# Altium schematic sheet 2016_Matrice_LED.SchDoc
size A4
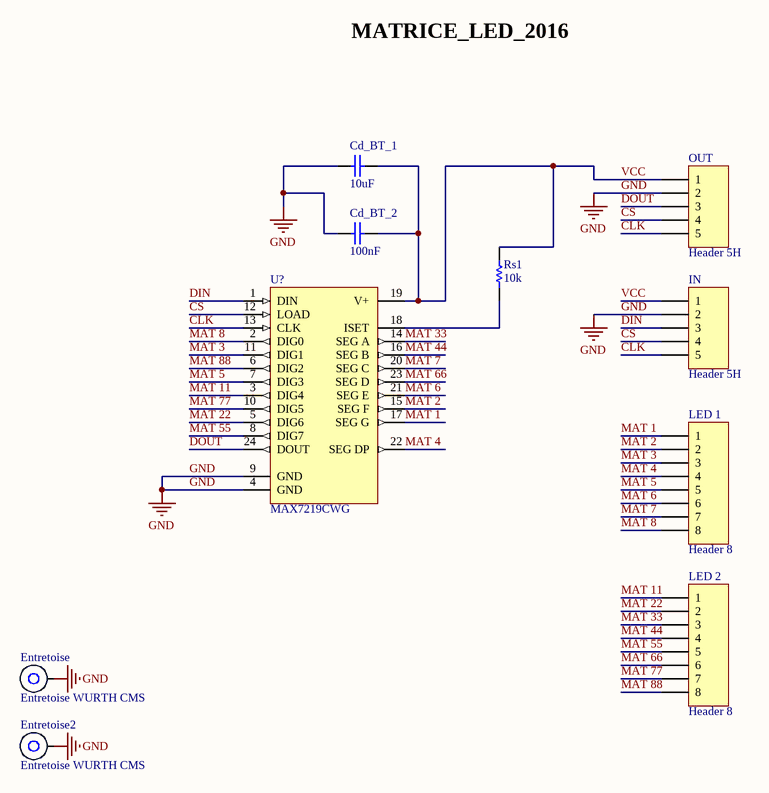
[diagram p0: 2016_Matrice_LED.SchDoc]

## Parts
Cd_BT_1  10uF  [C1206_N]
Cd_BT_2  100nF  [C0805_N]
Entretoise  Entretoise WURTH CMS  [ENTRETOISE_CMS]
Entretoise2  Entretoise WURTH CMS  [ENTRETOISE_CMS]
IN  Header 5H  [HDR1X5H]
LED_1  Header 8  [HDR1X8]
LED_2  Header 8  [HDR1X8]
OUT  Header 5H  [HDR1X5H]
Rs1  10k  [R1206_N]
U?  MAX7219CWG  [WSO24_L]

## Nets
GND: Cd_BT_1.2 Cd_BT_2.2 Entretoise.1 Entretoise2.1 IN.2 OUT.2 U?.4(GND) U?.9(GND)
CLK: IN.5 OUT.5 U?.13(CLK)
CS: IN.4 OUT.4 U?.12(LOAD)
DIN: IN.3 U?.1(DIN)
DOUT: OUT.3 U?.24(DOUT)
MAT 1: LED_1.1 U?.17(SEG_G)
MAT 2: LED_1.2 U?.15(SEG_F)
MAT 3: LED_1.3 U?.11(DIG1)
MAT 4: LED_1.4 U?.22(SEG_DP)
MAT 5: LED_1.5 U?.7(DIG3)
MAT 6: LED_1.6 U?.21(SEG_E)
MAT 7: LED_1.7 U?.20(SEG_C)
MAT 8: LED_1.8 U?.2(DIG0)
MAT 11: LED_2.1 U?.3(DIG4)
MAT 22: LED_2.2 U?.5(DIG6)
MAT 33: LED_2.3 U?.14(SEG_A)
MAT 44: LED_2.4 U?.16(SEG_B)
MAT 55: LED_2.5 U?.8(DIG7)
MAT 66: LED_2.6 U?.23(SEG_D)
MAT 77: LED_2.7 U?.10(DIG5)
MAT 88: LED_2.8 U?.6(DIG2)
VCC: Cd_BT_1.1 Cd_BT_2.1 IN.1 OUT.1 Rs1.2 U?.19(V+)
NetRs1_1: Rs1.1 U?.18(ISET)

## Notes on the sheet
- MATRICE_LED_2016
- Title
- Size:
- Date:
- A4
- Number:
- Time:
- Revision:
- Sheet
- of
- File:

## Library data of the parts
Cd_BT_1 Cd_BT_2 = Condensateur: Capacitor; Published: 8-Jun-2000; LatestRevisionDate: 17-Jul-2002; LatestRevisionNote: Re-released for DXP Platform.; PackageReference: RAD-0.3; Publisher: Altium Limited
Entretoise Entretoise2 = Entretoise WURTH CMS: Entretoise Wurth; Publisher: Damien Guitton
IN OUT = Header 5H: Header, 5-Pin, Right Angle; LatestRevisionDate: 17-Jul-2002; LatestRevisionNote: Re-released for DXP Platform.; Publisher: Altium Limited
LED_1 LED_2 = Header 8: Header, 8-Pin; LatestRevisionDate: 17-Jul-2002; LatestRevisionNote: Re-released for DXP Platform.; Publisher: Altium Limited
Rs1 = Resistor: Published: 8-Jun-2000; LatestRevisionDate: 17-Jul-2002; LatestRevisionNote: Re-released for DXP Platform.; PackageReference: AXIAL-0.5; Publisher: Altium Limited
U? = MAX7219CWG: Serially Interfaced, 8-Digit LED Display Driver; Published: 16-Jan-2001; LatestRevisionDate: 13-Apr-2006; LatestRevisionNote: IPC-7351 Footprint Added.; DatasheetVersion: Jul-1997; PackageReference: WSO24; Publisher: Altium Limited; PackageDescription: 24-Pin Small Outline Integrated Circuit 1.27 mm Pitch; ComponentLink1Description: Manufacturer Link; ComponentLink1URL: http://www.maxim-ic.com/; ComponentLink2Description: Datasheet; ComponentLink2URL: http://pdfserv.maxim-ic.com/en/ds/MAX7219-MAX7221.pdf